# EAGLE schematic termostat (EAGLE 9.6.2)
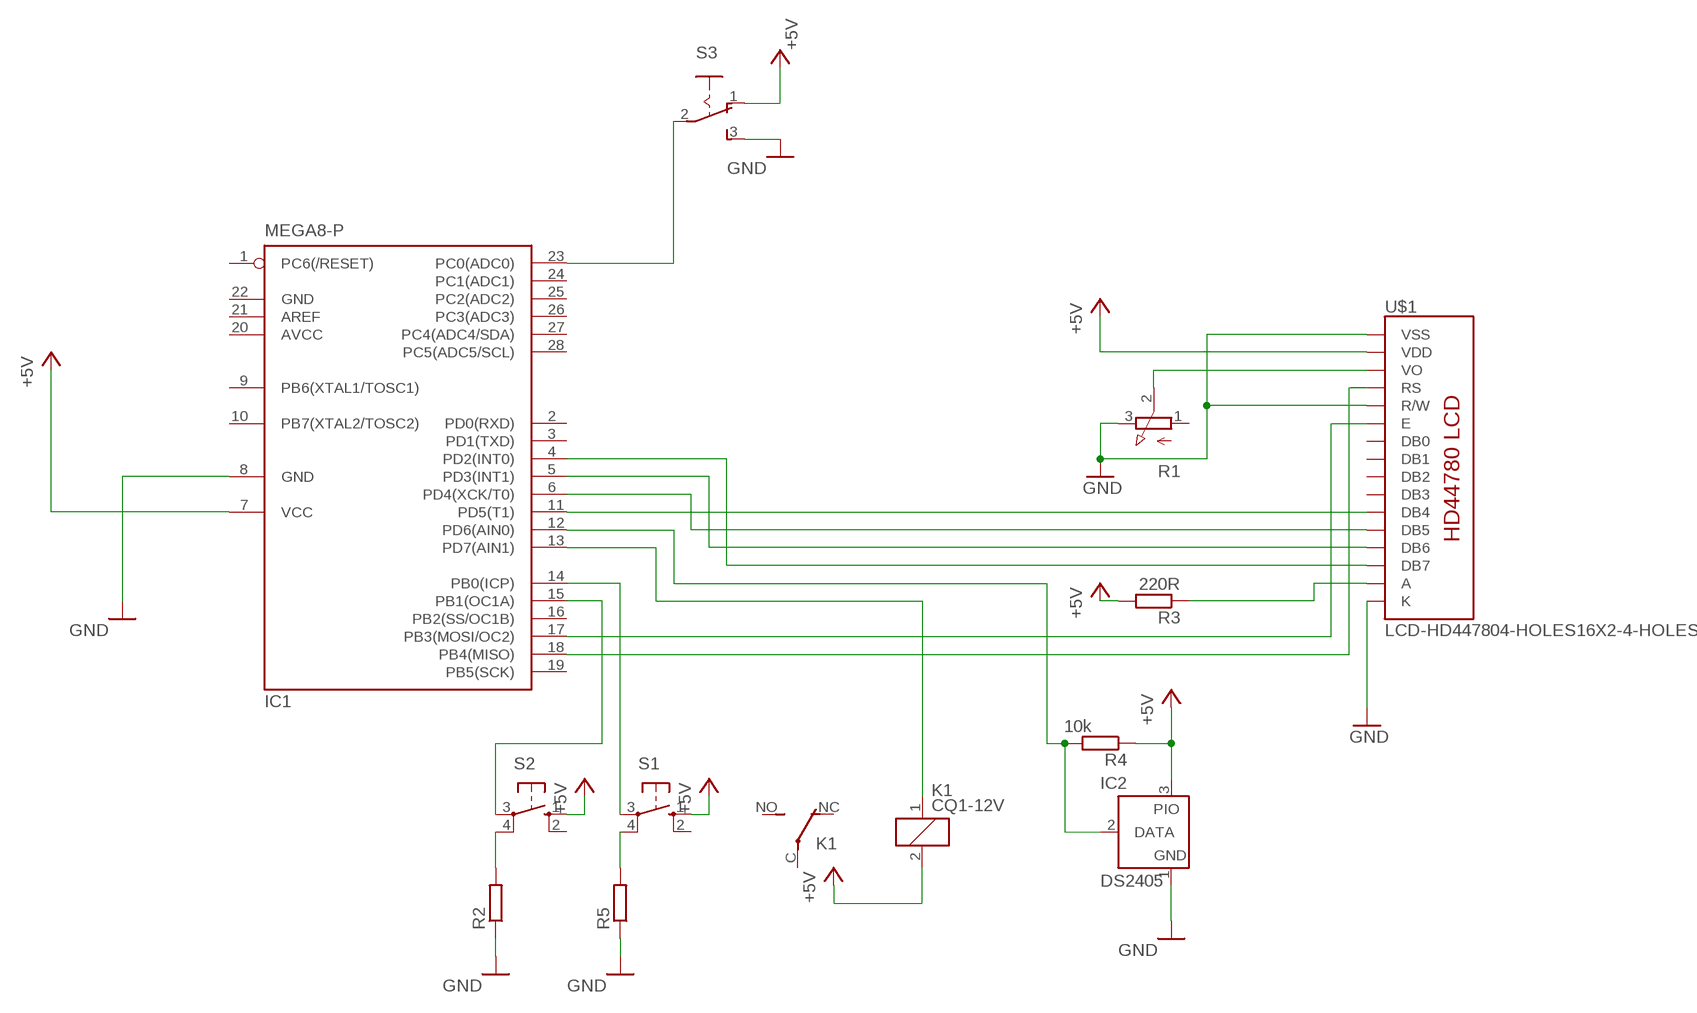
[diagram p0: schematic, sheet 1]

## Parts
IC1  MEGA8-P  [DIL28-3]
IC2  DS2405  [TO92-]
K1  CQ1-12V  [CQ1]
R1  3RP/1610N  [3RP/1610N]
R2  R-EU_0204/7  [0204/7]
R3  220R  R-EU_0204/7  [0204/7]
R4  10k  R-EU_0204/7  [0204/7]
R5  R-EU_0204/7  [0204/7]
S1  10-XX  [B3F-10XX]
S2  10-XX  [B3F-10XX]
S3  255SB  [255SB]
U$1  LCD-HD447804-HOLES16X2-4-HOLES  [LCD-16X2-4HOLES]

## Nets
+5V: IC1.7(VCC) IC2.3(PIO) K1.2 R3.2 R4.1 S1.1(S) S2.1(S) S3.1(O) U$1.2(VDD)
GND: IC1.8(GND) IC2.1(GND) R1.3(E) R2.1 R5.1 S3.3(S) U$1.1(VSS) U$1.5(R/W) U$1.16(K)
N$1: R1.2(S) U$1.3(VO)
N$2: IC1.17(PB3(MOSI/OC2)) U$1.6(E)
N$3: IC1.6(PD4(XCK/T0)) U$1.12(DB5)
N$4: IC1.11(PD5(T1)) U$1.11(DB4)
N$5: IC1.5(PD3(INT1)) U$1.13(DB6)
N$6: IC1.4(PD2(INT0)) U$1.14(DB7)
N$7: R3.1 U$1.15(A)
N$8: IC1.18(PB4(MISO)) U$1.4(RS)
N$9: IC1.23(PC0(ADC0)) S3.2(P)
N$10: R5.2 S1.4(P1)
N$11: IC1.13(PD7(AIN1)) K1.1
N$12: IC1.12(PD6(AIN0)) IC2.2(DATA) R4.2
N$13: R2.2 S2.4(P1)
N$14: IC1.14(PB0(ICP)) S1.3(P)
N$15: IC1.15(PB1(OC1A)) S2.3(P)
Unconnected: IC1.1(PC6(/RESET)) IC1.2(PD0(RXD)) IC1.3(PD1(TXD)) IC1.9(PB6(XTAL1/TOSC1)) IC1.10(PB7(XTAL2/TOSC2)) IC1.16(PB2(SS/OC1B)) IC1.19(PB5(SCK)) IC1.21(AREF) IC1.24(PC1(ADC1)) IC1.25(PC2(ADC2)) IC1.26(PC3(ADC3)) IC1.27(PC4(ADC4/SDA)) IC1.28(PC5(ADC5/SCL)) K1.C(2:P) K1.NC(2:O) K1.NO(2:S) R1.1(A) S1.2(S1) S2.2(S1) U$1.7(DB0) U$1.8(DB1) U$1.9(DB2) U$1.10(DB3)

## Power pins joined to a net without a drawn wire
AVCC: IC1.20(AVCC)
GND: IC1.22(GND)

## Library data of the parts
IC1 = atmel:MEGA8-P: MICROCONTROLLER 8 Kbytes FLASH, 1 kbytes SRAM, 512 bytes EEPROM, USART, 4-channel 10 bit ADC, 2-channel 8 bit ADC Pin compatible with Atmega48, ATMega88, ATMega168 Source: avr.lbr; OC_FARNELL: unknown; OC_NEWARK: unknown
IC2 = maxim:DS2405: Addressable Switch DALLAS Semiconductor; MF: DALLAS SEMICONDUCTOR; MPN: DS2405; OC_FARNELL: 1188025; OC_NEWARK: 06F4645
K1 = relay:CQ1-12V: AUTOMOTIVE QUIET RELAY NAiS Source: http://www.mew-europe.com/.. en_ds_61208_0000.pdf; OC_FARNELL: unknown; OC_NEWARK: unknown
R1 = pot:3RP/1610N: 16mm Potentiometer one level Source: http://www.alphapotentiometers.net/html/16mm_pot_2.html
R2-R5 = rcl:R-EU_: RESISTOR, European symbol; SPICEPREFIX: R
S1 S2 = switch-omron:10-XX: OMRON SWITCH; MPN: B3F-1000; OC_FARNELL: 176432; OC_NEWARK: 36M3542
S3 = switch:255SB: SLIDING SWITCH Distributor Buerklin, 11G810
U$1 = HD44780LCD:LCD-HD44780